# Altium schematic sheet ph.SchDoc: Science Board pH Sensing
size A4
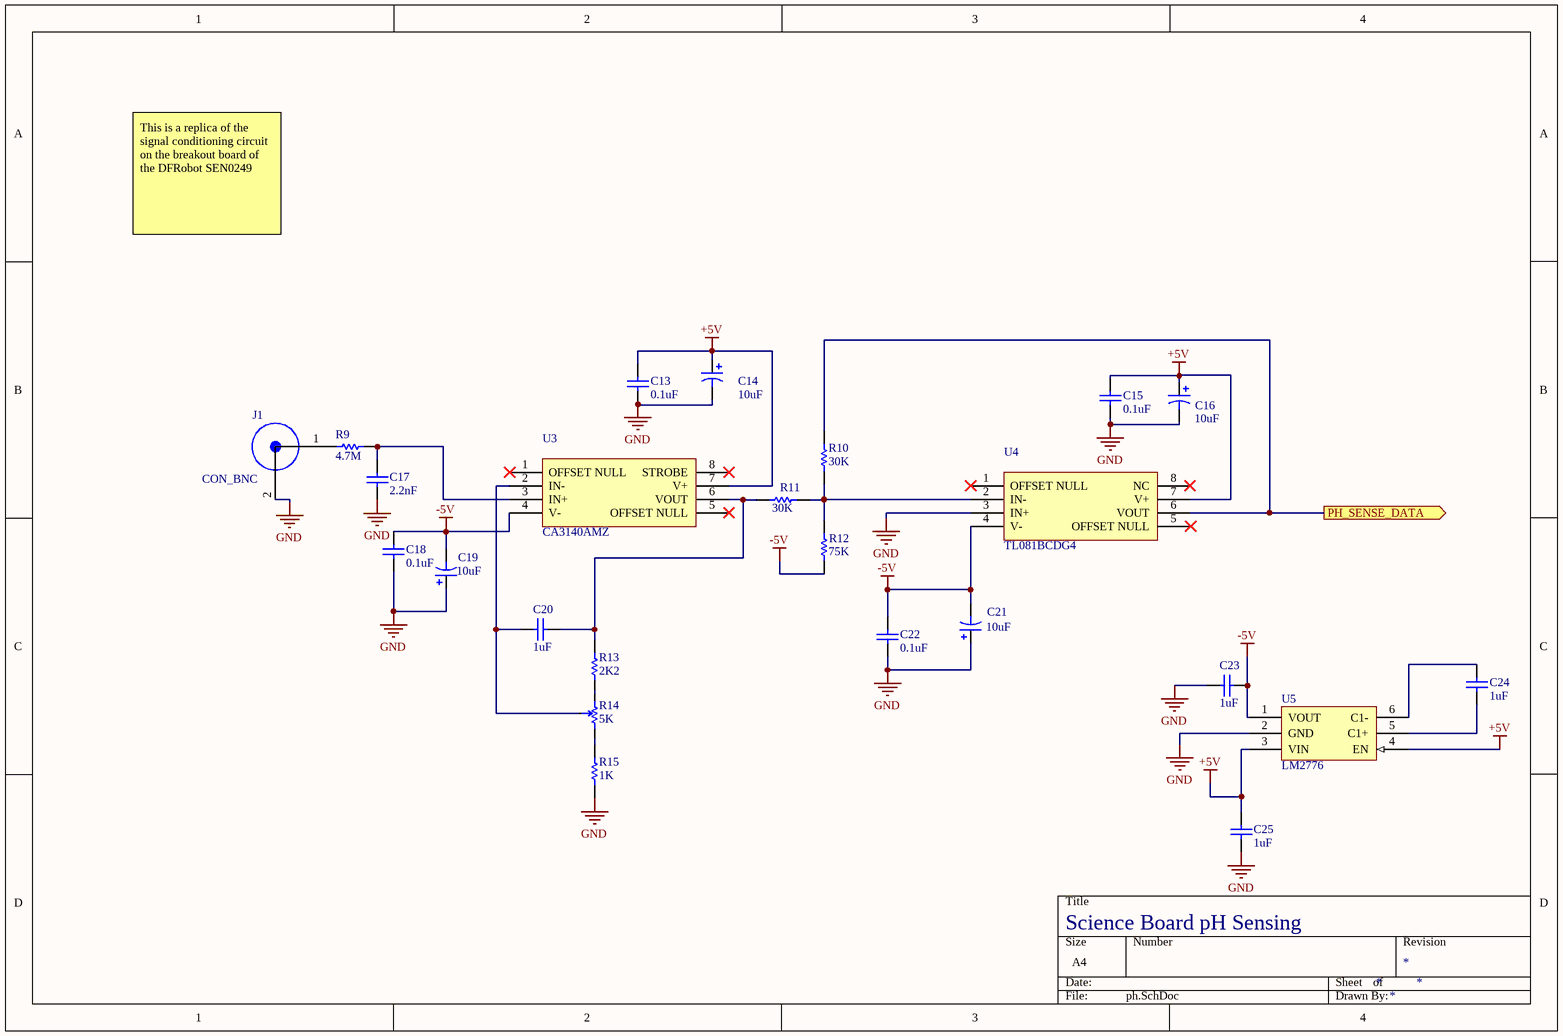
[diagram p0: ph.SchDoc]

## Parts
C13  value 0.1uF  [CAPC0603(1608)55_N]  (hidden comment: CAP_0.1uF_50V_0603)
C14  value 10uF  [AVX-CAPC3528_V]  (hidden comment: CAP_10uF_0603_POL)
C15  value 0.1uF  [CAPC0603(1608)55_N]  (hidden comment: CAP_0.1uF_50V_0603)
C16  value 10uF  [AVX-CAPC3528_V]  (hidden comment: CAP_10uF_0603_POL)
C17  value 2.2nF  [CAPC0603(1608)55_N]  (hidden comment: CAP_2.2nF_0603)
C18  value 0.1uF  [CAPC0603(1608)55_N]  (hidden comment: CAP_0.1uF_50V_0603)
C19  value 10uF  [AVX-CAPC3528_V]  (hidden comment: CAP_10uF_0603_POL)
C20  value 1uF  [CAPC0603(1608)55_N]  (hidden comment: CAP_1uF_16V_0603)
C21  value 10uF  [AVX-CAPC3528_V]  (hidden comment: CAP_10uF_0603_POL)
C22  value 0.1uF  [CAPC0603(1608)55_N]  (hidden comment: CAP_0.1uF_50V_0603)
C23  value 1uF  [CAPC0603(1608)55_N]  (hidden comment: CAP_1uF_16V_0603)
C24  value 1uF  [CAPC0603(1608)55_N]  (hidden comment: CAP_1uF_16V_0603)
C25  value 1uF  [CAPC0603(1608)55_N]  (hidden comment: CAP_1uF_16V_0603)
J1  CON_BNC  [1-1337543-0]
R9  value 4.7M  [RESC0603(1608)_N]  (hidden comment: RES_4M7_0603)
R10  value 30K  [RESC0603(1608)_N]  (hidden comment: RES_30K_0603)
R11  value 30K  [RESC0603(1608)_N]  (hidden comment: RES_30K_0603)
R12  value 75K  [RESC0603(1608)_N]  (hidden comment: RES_75K_0603)
R13  value 2K2  [RESC0603(1608)_N]  (hidden comment: RES_2K2_0603)
R14  value 5K  [3362P-1-502LF]  (hidden comment: POT_5K)
R15  value 1K  [RESC0603(1608)_N]  (hidden comment: RES_1K_0603)
U3  CA3140AMZ  [CA3140AMZ]
U4  TL081BCDG4  [TL081BCDG4]
U5  LM2776  [SOT23-6]

## Ports
PH_SENSE_DATA (out)

## Nets
+5V: C13.2 C14.1 C15.2 C16.1 C25.2 U3.7(V+) U4.7(V+) U5.3(VIN) U5.4(EN)
-5V: C18.2 C19.2 C21.2 C22.2 C23.1 R12.1 U3.4(V-) U4.4(V-) U5.1(VOUT)
GND: C13.1 C14.2 C15.1 C16.2 C17.1 C18.1 C19.1 C21.1 C22.1 C23.2 C25.1 J1.2 R15.1 U4.3(IN+) U5.2(GND)
PH_SENSE_DATA: R10.2 U4.6(VOUT) ; port PH_SENSE_DATA
NetC17_2: C17.2 R9.2 U3.3(IN+)
NetC20_1: C20.1 R14.3 U3.2(IN-)
NetC20_2: C20.2 R11.1 R13.2 U3.6(VOUT)
NetC24_1: C24.1 U5.5(C1+)
NetC24_2: C24.2 U5.6(C1-)
NetJ1_1: J1.1 R9.1
NetR10_1: R10.1 R11.2 R12.2 U4.2(IN-)
NetR13_1: R13.1 R14.1
NetR14_2: R14.2 R15.2

Not connected (* = marked no-connect by the designer): U3 1(OFFSET_NULL)* 5(OFFSET_NULL)* 8(STROBE)*; U4 1(OFFSET_NULL)* 5(OFFSET_NULL)* 8(NC)*

## Notes on the sheet
- This is a replica of the signal conditioning circuit on the breakout board of the DFRobot SEN0249

## Library data of the parts
C13 C15 C18 C22 = CAP_0.1uF_50V_0603: CAP CER 0.1UF 50V X7R 0603; Part Number: GCM188R71H104KA57D; Manufacturer: Yageo; Dimensions: 0.063" L x 0.031" W (1.60mm x 0.80mm); Package: 0603 (1608 Metric); Temperature Coefficient: X7R; Voltage Rating: 50V
C14 C16 C19 C21 = CAP_10uF_0603_POL: Capacitor, Tantalum, 10uF 10% 20V MCCT-B (3528); Part Number: CC0603MRX5R6BB106; Manufacturer: Yageo; Temperature Coefficient: X5R; Voltage Rating: 10V; Dimensions: 0.063" L x 0.031" W (1.60mm x 0.80mm); Package: 0603 (1608 Metric)
C17 = CAP_2.2nF_0603: CAP CER 2.2NF 25V X7R 0603; Part Number: CC0603KRX7R8BB222; Manufacturer: Yageo; Dimensions: 0.063" L x 0.031" W (1.60mm x 0.80mm); Package: 0603 (1608 Metric); Temperature Coefficient: X7R; Voltage Rating: 25V
C20 C23-C25 = CAP_1uF_16V_0603: CAP CER 1UF 16V Y5V 0603; Part Number: CC0603ZRY5V7BB105; Manufacturer: Yageo; Dimensions: 0.063" L x 0.031" W (1.60mm x 0.80mm); Package: 0603 (1608 Metric); Temperature Coefficient: Y5V; Voltage Rating: 16V
J1 = CON_BNC: Manufacturer: TE Connectivity; Part Number (MPN): 1-1337543-0
R9 = RES_4M7_0603: RES SMD 4.7M OHM 1% 1/10W 0603; Part Number (MPN): RC0603FR-074M7L; Manufacturer: Yageo; Package: 0603 (1608 Metric); Dimensions: 0.063" L x 0.031" W (1.60mm x 0.80mm); Tolerance: 1%
R10 R11 = RES_30K_0603: RES SMD 30K OHM 0.5% 1/10W 0603; Manufacturer: Yageo; Part Number (MPN): RT0603DRD0730KL; Package: 0603 (1608 Metric); Dimensions: 0.063" L x 0.031" W (1.60mm x 0.80mm); Tolerance: 0.5%; Digikey Part Number: 311-30KDCT-ND
R12 = RES_75K_0603: RES SMD 75K OHM 0.5% 1/10W 0603; Manufacturer: Yageo; Part Number (MPN): RT0603DRD0775KL; Package: 0603 (1608 Metric); Dimensions: 0.063" L x 0.031" W (1.60mm x 0.80mm); Tolerance: 0.5%; Digikey Part Number: 311-75KDCT-ND
R13 = RES_2K2_0603: RES SMD 2.2K OHM 1% 1/10W 0603; Manufacturer: Yageo; Part Number (MPN): RC0603FR-072K2L; Dimensions: 0.063" L x 0.031" W (1.60mm x 0.80mm); Package: 0603 (1608 Metric); Tolerance: 1%
R14 = POT_5K: TRIMMER 5K OHM 0.5W PC PIN TOP; Manufacturer: Bourns Inc.; Tolerance: 10%; Part Number (MPN): 3362P-1-502LF; Dimensions: 0.275" x 0.260" Face x 0.185" H (6.99mm x 6.60mm x 4.70mm)
R15 = RES_1K_0603: RES SMD 1K OHM 5% 1/10W 0603; Manufacturer: Yageo; Part Number (MPN): RC0603JR-071KL; Dimensions: 0.063" L x 0.031" W (1.60mm x 0.80mm); Tolerance: 5%; Package: 0603 (1608 Metric)
U3 = CA3140AMZ: 4.5MHz, BiMOS Operational Amplifier with MOSFET Input/Bipolar Output
U4 = TL081BCDG4: IC OPAMP JFET 3MHZ 8SOIC; Parameter 1: *
U5 = LM2776: LM2776 Switched Capacitor Inverter